# EAGLE board sboardnew (EAGLE 6.6.0), part 1 of 2
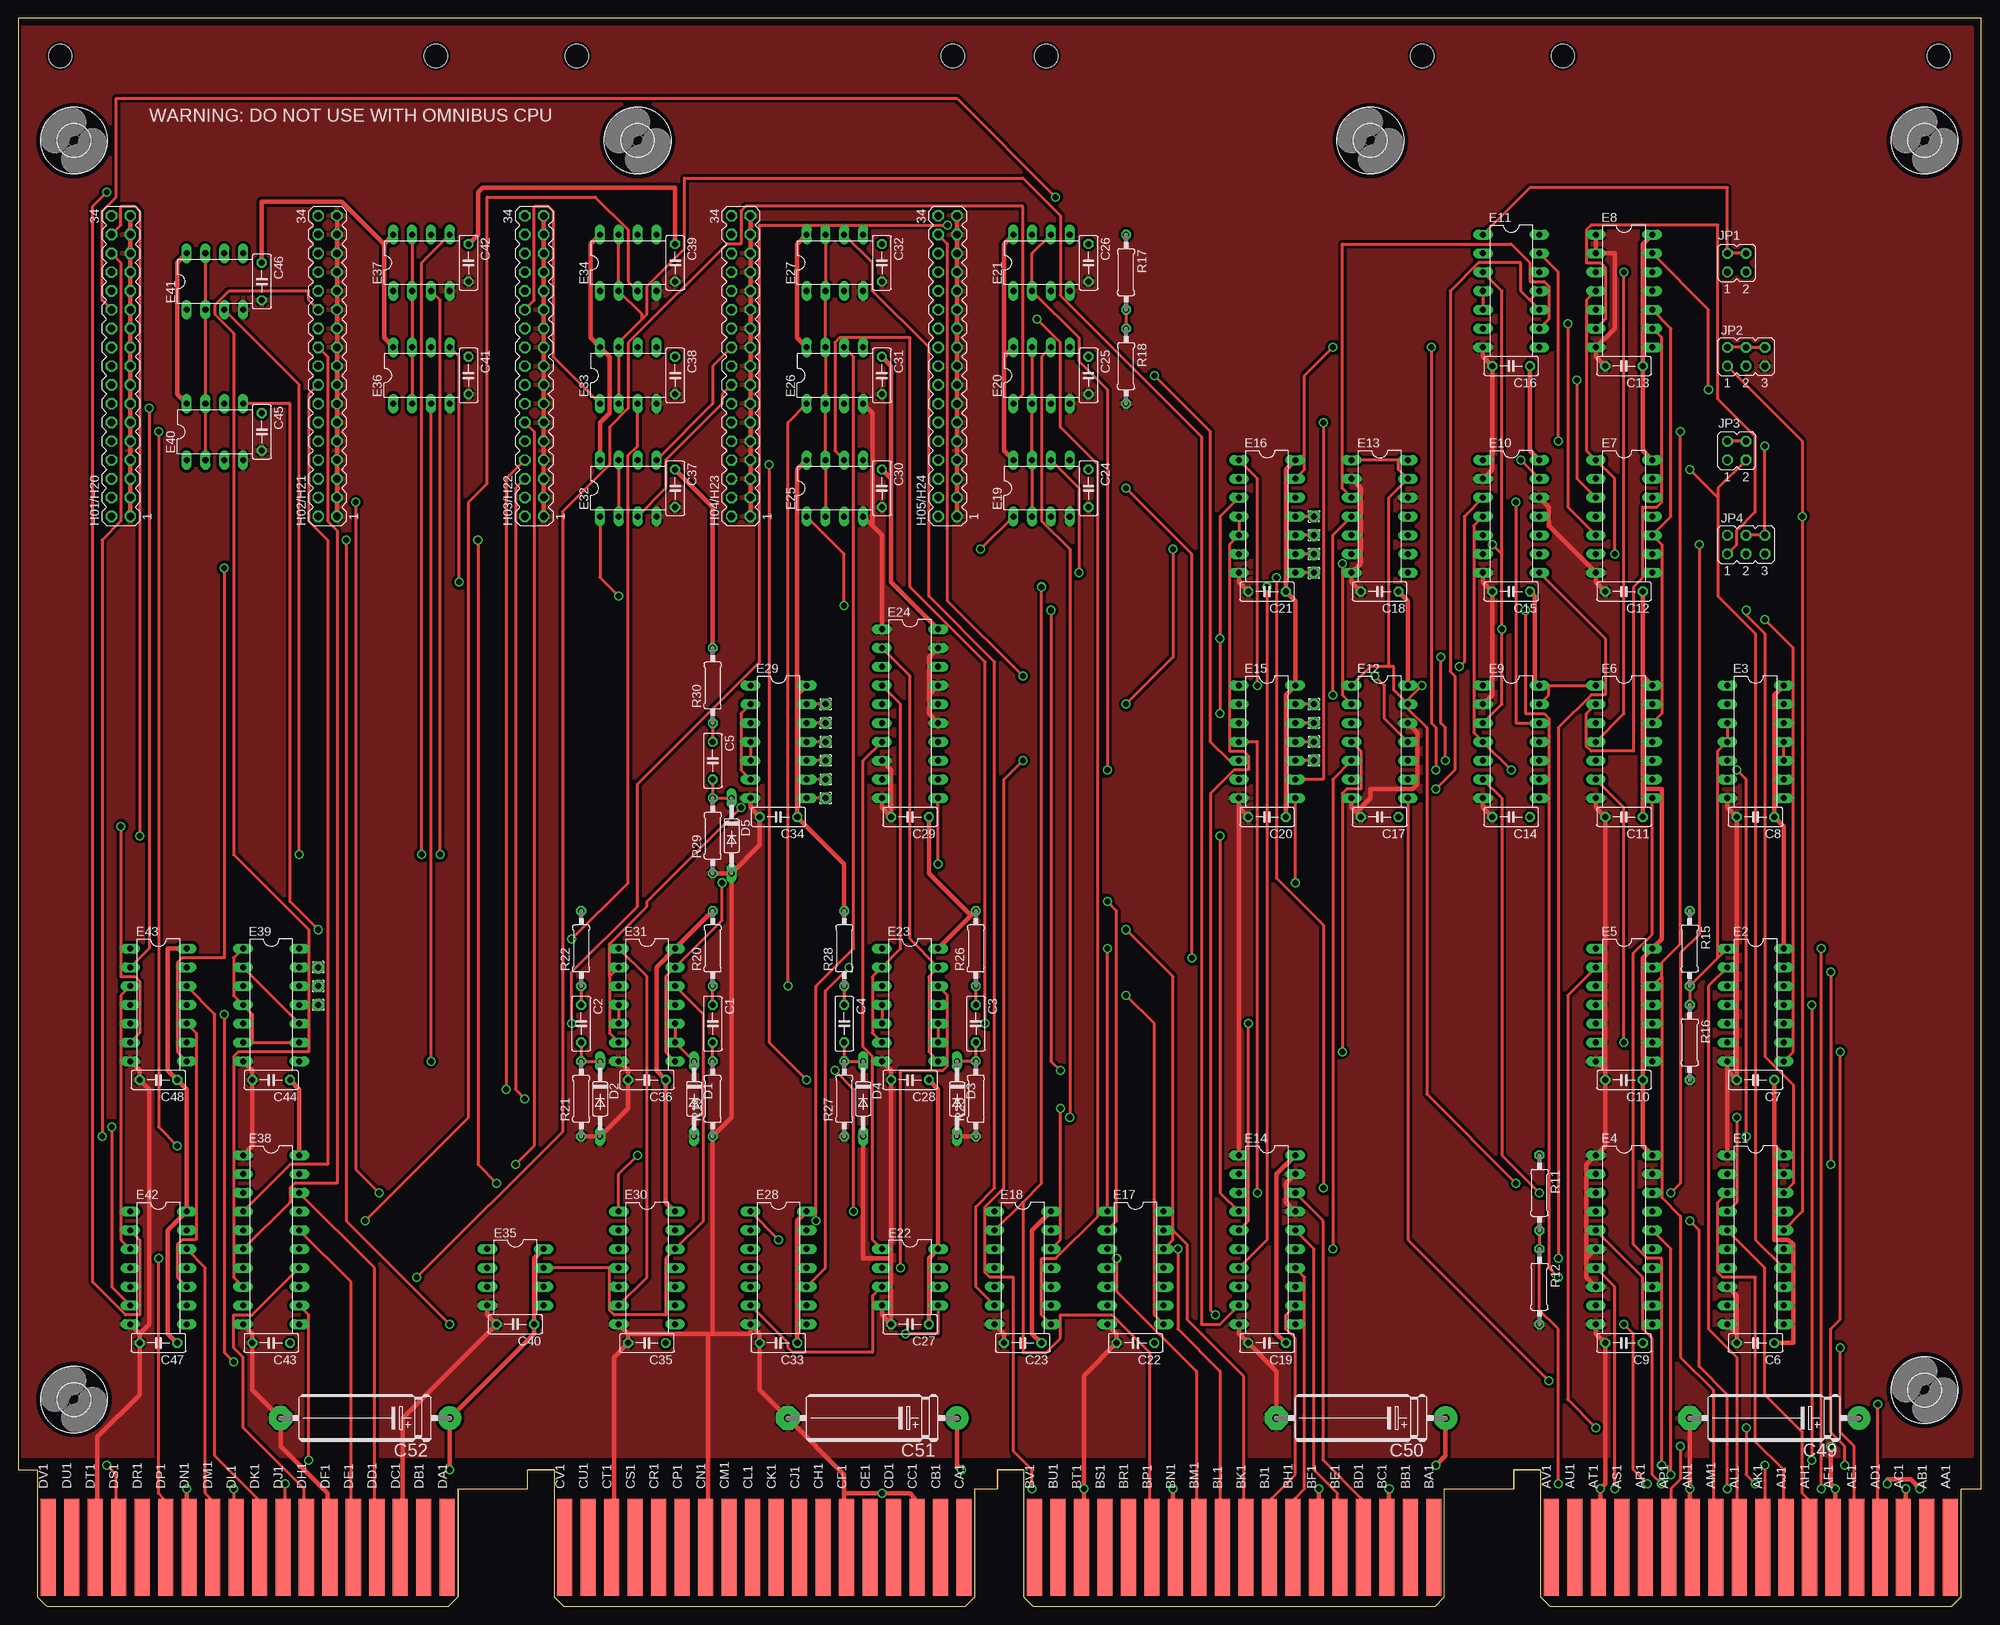
[diagram p5: board, top side]
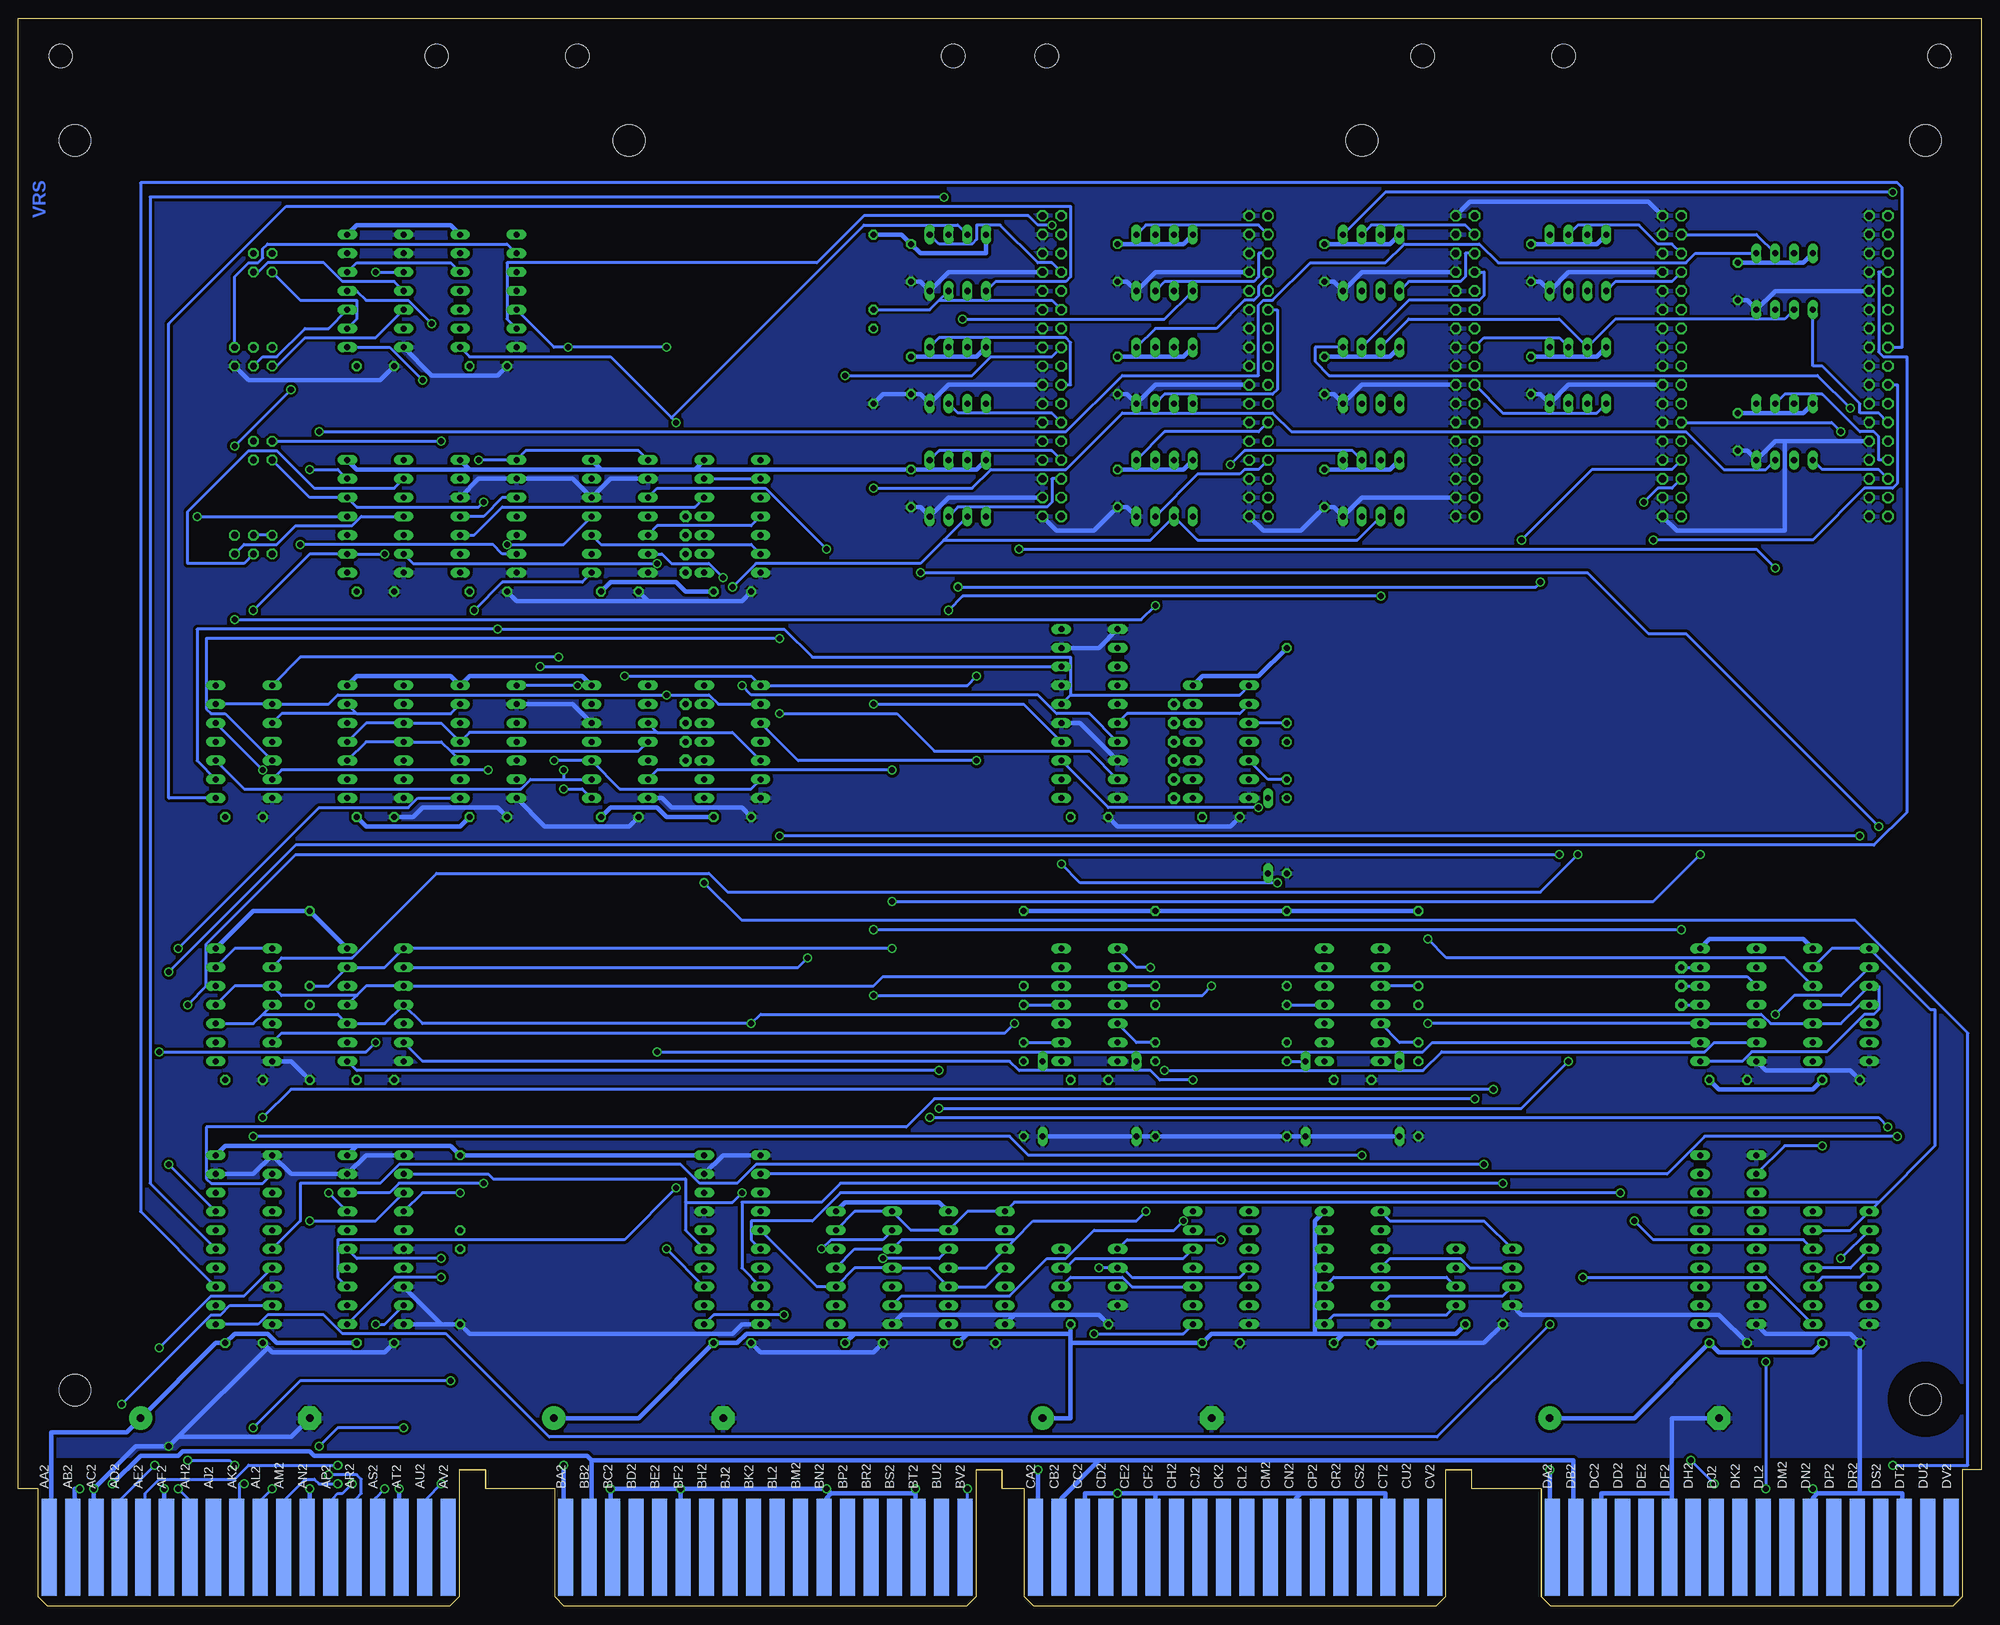
[diagram p6: board, bottom side, seen from below]

Size 265.3 x 214.63 mm. Coordinates in mm from the lower left corner, seen from the top.
Copper layers (1+16): Top 0.035mm / dielectric 1.5mm / Bottom 0.035mm
Design rules "16mils": minimum track width 16mil, minimum drill 32mil, track to track 15mil, track to pad 10mil, pad to pad 10mil, via to via 10mil, smd to smd 10mil, copper to edge 13mil, drill to drill 10mil, minimum pad ring 10mil, minimum via ring 8mil, stop-mask expansion 0mil, vias tented up to drill 0mil, thermal gap 10mil
Net classes: 1 Power: width 0.635 mm

## Footprints (pad centres in the part's own frame; a part is rotated, then mirrored left to right if it is on the bottom)
C050-025X075 = drill 0.813 octagon: 1 -2.54,0; 2 2.54,0
E22-6 = drill 1.016 pad 3.15: + -11.43,0 | drill 1.016 pad 3.15 octagon: - 11.43,0
DO35-10 = drill 0.813 long: A 5.08,0; C -5.08,0
DIL20 = drill 0.813 long: 1 -11.43,-3.81; 2 -8.89,-3.81; 3 -6.35,-3.81; 4 -3.81,-3.81; 5 -1.27,-3.81; 6 1.27,-3.81; 7 3.81,-3.81; 8 6.35,-3.81; 9 8.89,-3.81; 10 11.43,-3.81; 11 11.43,3.81; 12 8.89,3.81; 13 6.35,3.81; 14 3.81,3.81; 15 1.27,3.81; 16 -1.27,3.81; 17 -3.81,3.81; 18 -6.35,3.81; 19 -8.89,3.81; 20 -11.43,3.81
DIL14 = drill 0.813 long: 1 -7.62,-3.81; 2 -5.08,-3.81; 3 -2.54,-3.81; 4 0,-3.81; 5 2.54,-3.81; 6 5.08,-3.81; 7 7.62,-3.81; 8 7.62,3.81; 9 5.08,3.81; 10 2.54,3.81; 11 0,3.81; 12 -2.54,3.81; 13 -5.08,3.81; 14 -7.62,3.81
DIL08 = drill 0.813 long: 1 -3.81,-3.81; 2 -1.27,-3.81; 3 1.27,-3.81; 4 3.81,-3.81; 5 3.81,3.81; 6 1.27,3.81; 7 -1.27,3.81; 8 -3.81,3.81
MA17-2 = drill 1.016 octagon: 1 -20.32,-1.27; 2 -20.32,1.27; 3 -17.78,-1.27; 4 -17.78,1.27; 5 -15.24,-1.27; 6 -15.24,1.27; 7 -12.7,-1.27; 8 -12.7,1.27; 9 -10.16,-1.27; 10 -10.16,1.27; 11 -7.62,-1.27; 12 -7.62,1.27; 13 -5.08,-1.27; 14 -5.08,1.27; 15 -2.54,-1.27; 16 -2.54,1.27; 17 0,-1.27; 18 0,1.27; 19 2.54,-1.27; 20 2.54,1.27; 21 5.08,-1.27; 22 5.08,1.27; 23 7.62,-1.27; 24 7.62,1.27; 25 10.16,-1.27; 26 10.16,1.27; 27 12.7,-1.27; 28 12.7,1.27; 29 15.24,-1.27; 30 15.24,1.27; 31 17.78,-1.27; 32 17.78,1.27; 33 20.32,-1.27; 34 20.32,1.27
JP2Q = drill 0.914 octagon: 1 -1.27,-1.27; 2 -1.27,1.27; 3 1.27,-1.27; 4 1.27,1.27
JP3Q = drill 0.914 octagon: 1 -2.54,-1.27; 2 -2.54,1.27; 3 0,-1.27; 4 0,1.27; 5 2.54,-1.27; 6 2.54,1.27
1,6/0,8 = drill 0.813 pad 1.6 octagon: 1 0,0
0207/10 = drill 0.813 octagon: 1 -5.08,0; 2 5.08,0
EDGE-CON8 = smd 2.032 x 13.106: AA1 261.303,7.938; AB1 258.127,7.938; AC1 254.952,7.938; AD1 251.778,7.938; AE1 248.602,7.938; AF1 245.428,7.938; AH1 242.252,7.938; AJ1 239.077,7.938; AK1 235.903,7.938; AL1 232.727,7.938; AM1 229.553,7.938; AN1 226.377,7.938; AP1 223.202,7.938; AR1 220.028,7.938; AS1 216.852,7.938; AT1 213.678,7.938; AU1 210.502,7.938; AV1 207.327,7.938; BA1 191.452,7.938; BB1 188.278,7.938; BC1 185.102,7.938; BD1 181.928,7.938; BE1 178.752,7.938; BF1 175.577,7.938; BH1 172.403,7.938; BJ1 169.227,7.938; BK1 166.053,7.938; BL1 162.877,7.938; BM1 159.702,7.938; BN1 156.528,7.938; BP1 153.352,7.938; BR1 150.178,7.938; BS1 147.002,7.938; BT1 143.827,7.938; BU1 140.653,7.938; BV1 137.477,7.938; CA1 127.953,7.938; CB1 124.778,7.938; CC1 121.603,7.938; CD1 118.427,7.938; CE1 115.252,7.938; CF1 112.078,7.938; CH1 108.903,7.938; CJ1 105.728,7.938; CK1 102.552,7.938; CL1 99.377,7.938; CM1 96.203,7.938; CN1 93.028,7.938; CP1 89.853,7.938; CR1 86.677,7.938; CS1 83.502,7.938; CT1 80.328,7.938; CU1 77.153,7.938; CV1 73.978,7.938; DA1 58.102,7.938; DB1 54.928,7.938; DC1 51.752,7.938; DD1 48.578,7.938; DE1 45.403,7.938; DF1 42.227,7.938; DH1 39.053,7.938; DJ1 35.877,7.938; DK1 32.703,7.938; DL1 29.527,7.938; DM1 26.352,7.938; DN1 23.177,7.938; DP1 20.003,7.938; DR1 16.828,7.938; DS1 13.652,7.938; DT1 10.477,7.938; DU1 7.303,7.938; DV1 4.128,7.938 | smd 2.032 x 13.106 bottom: AA2 261.303,7.938; AB2 258.127,7.938; AC2 254.952,7.938; AD2 251.778,7.938; AE2 248.602,7.938; AF2 245.428,7.938; AH2 242.252,7.938; AJ2 239.077,7.938; AK2 235.903,7.938; AL2 232.727,7.938; AM2 229.553,7.938; AN2 226.377,7.938; AP2 223.202,7.938; AR2 220.028,7.938; AS2 216.852,7.938; AT2 213.678,7.938; AU2 210.502,7.938; AV2 207.327,7.938; BA2 191.452,7.938; BB2 188.278,7.938; BC2 185.102,7.938; BD2 181.928,7.938; BE2 178.752,7.938; BF2 175.577,7.938; BH2 172.403,7.938; BJ2 169.227,7.938; BK2 166.053,7.938; BL2 162.877,7.938; BM2 159.702,7.938; BN2 156.528,7.938; BP2 153.352,7.938; BR2 150.178,7.938; BS2 147.002,7.938; BT2 143.827,7.938; BU2 140.653,7.938; BV2 137.477,7.938; CA2 127.953,7.938; CB2 124.778,7.938; CC2 121.603,7.938; CD2 118.427,7.938; CE2 115.252,7.938; CF2 112.078,7.938; CH2 108.903,7.938; CJ2 105.728,7.938; CK2 102.552,7.938; CL2 99.377,7.938; CM2 96.203,7.938; CN2 93.028,7.938; CP2 89.853,7.938; CR2 86.677,7.938; CS2 83.502,7.938; CT2 80.328,7.938; CU2 77.153,7.938; CV2 73.978,7.938; DA2 58.102,7.938; DB2 54.928,7.938; DC2 51.752,7.938; DD2 48.578,7.938; DE2 45.403,7.938; DF2 42.227,7.938; DH2 39.053,7.938; DJ2 35.877,7.938; DK2 32.703,7.938; DL2 29.527,7.938; DM2 26.352,7.938; DN2 23.177,7.938; DP2 20.003,7.938; DR2 16.828,7.938; DS2 13.652,7.938; DT2 10.477,7.938; DU2 7.303,7.938; DV2 4.128,7.938
OMNIBUS = hole 3.175: 208.915,209.55; 259.715,209.55; 189.865,209.55; 139.065,209.55; 75.616,209.55; 126.416,209.55; 56.566,209.55; 5.766,209.55
4,3 = hole 4.3: 0,0

## Placement (x,y rotation side)
C1  .22uf  [C050-025X075]  93.85,78.74 270 top
C2  .22uf  [C050-025X075]  76.07,78.74 270 top
C3  .22uf  [C050-025X075]  129.41,78.74 270 top
C4  .22uf  [C050-025X075]  111.63,78.74 270 top
C5  .22uf  [C050-025X075]  93.85,114.3 270 top
C6  [C050-025X075]  234.82,35.56 180 top
C7  [C050-025X075]  234.82,71.12 180 top
C8  [C050-025X075]  234.82,106.68 180 top
C9  [C050-025X075]  217.04,35.56 180 top
C10  [C050-025X075]  217.04,71.12 180 top
C11  [C050-025X075]  217.04,106.68 180 top
C12  [C050-025X075]  217.04,137.16 180 top
C13  [C050-025X075]  217.04,167.64 180 top
C14  [C050-025X075]  201.8,106.68 180 top
C15  [C050-025X075]  201.8,137.16 180 top
C16  [C050-025X075]  201.8,167.64 180 top
C17  [C050-025X075]  184.02,106.68 180 top
C18  [C050-025X075]  184.02,137.16 180 top
C19  [C050-025X075]  168.78,35.56 180 top
C20  [C050-025X075]  168.78,106.68 180 top
C21  [C050-025X075]  168.78,137.16 180 top
C22  [C050-025X075]  151,35.56 180 top
C23  [C050-025X075]  135.76,35.56 180 top
C24  [C050-025X075]  144.65,151.13 270 top
C25  [C050-025X075]  144.65,166.37 270 top
C26  [C050-025X075]  144.65,181.61 270 top
C27  [C050-025X075]  120.52,38.1 180 top
C28  [C050-025X075]  120.52,71.12 180 top
C29  [C050-025X075]  120.52,106.68 180 top
C30  [C050-025X075]  116.71,151.13 270 top
C31  [C050-025X075]  116.71,166.37 270 top
C32  [C050-025X075]  116.71,181.61 270 top
C33  [C050-025X075]  102.74,35.56 180 top
C34  [C050-025X075]  102.74,106.68 180 top
C35  [C050-025X075]  84.96,35.56 180 top
C36  [C050-025X075]  84.96,71.12 180 top
C37  [C050-025X075]  88.77,151.13 270 top
C38  [C050-025X075]  88.77,166.37 270 top
C39  [C050-025X075]  88.77,181.61 270 top
C40  [C050-025X075]  67.18,38.1 180 top
C41  [C050-025X075]  60.83,166.37 270 top
C42  [C050-025X075]  60.83,181.61 270 top
C43  [C050-025X075]  34.16,35.56 180 top
C44  [C050-025X075]  34.16,71.12 180 top
C45  [C050-025X075]  32.89,158.75 270 top
C46  [C050-025X075]  32.89,179.07 270 top
C47  [C050-025X075]  18.92,35.56 180 top
C48  [C050-025X075]  18.92,71.12 180 top
C49  [E22-6]  237.36,25.4 180 top
C50  [E22-6]  181.48,25.4 180 top
C51  [E22-6]  115.44,25.4 180 top
C52  [E22-6]  46.86,25.4 180 top
D1  D664  [DO35-10]  91.31,68.58 270 top
D2  D664  [DO35-10]  78.61,68.58 270 top
D3  D664  [DO35-10]  126.87,68.58 270 top
D4  D664  [DO35-10]  114.17,68.58 270 top
D5  D664  [DO35-10]  96.39,104.14 270 top
E1  74S240N  [DIL20]  234.82,49.53 270 top
E2  74S74N  [DIL14]  234.82,81.28 270 top
E3  7410N  [DIL14]  234.82,116.84 270 top
E4  74S240N  [DIL20]  217.04,49.53 270 top
E5  74S74N  [DIL14]  217.04,81.28 270 top
E6  74S74N  [DIL14]  217.04,116.84 270 top
E7  7404N  [DIL14]  217.04,147.32 270 top
E8  7400N  [DIL14]  217.04,177.8 270 top
E9  74S74N  [DIL14]  201.8,116.84 270 top
E10  74S74N  [DIL14]  201.8,147.32 270 top
E11  7410N  [DIL14]  201.8,177.8 270 top
E12  74S74N  [DIL14]  184.02,116.84 270 top
E13  74S74N  [DIL14]  184.02,147.32 270 top
E14  74S240N  [DIL20]  168.78,49.53 270 top
E15  7404N  [DIL14]  168.78,116.84 270 top
E16  7410N  [DIL14]  168.78,147.32 270 top
E17  74S74N  [DIL14]  151,45.72 270 top
E18  74S74N  [DIL14]  135.76,45.72 270 top
E19  DS75453N  [DIL08]  138.3,151.13 0 top
E20  DS75453N  [DIL08]  138.3,166.37 0 top
E21  DS75453N  [DIL08]  138.3,181.61 0 top
E22  DS1100M-250  [DIL08]  120.52,44.45 270 top
E23  7400N  [DIL14]  120.52,81.28 270 top
E24  74S240N  [DIL20]  120.52,120.65 270 top
E25  DS75453N  [DIL08]  110.36,151.13 0 top
E26  DS75453N  [DIL08]  110.36,166.37 0 top
E27  DS75453N  [DIL08]  110.36,181.61 0 top
E28  DS1005-250  [DIL14]  102.74,45.72 270 top
E29  7400N  [DIL14]  102.74,116.84 270 top
E30  DS1005-250  [DIL14]  84.96,45.72 270 top
E31  7400N  [DIL14]  84.96,81.28 270 top
E32  DS75453N  [DIL08]  82.42,151.13 0 top
E33  DS75453N  [DIL08]  82.42,166.37 0 top
E34  DS75453N  [DIL08]  82.42,181.61 0 top
E35  DS1100M-250  [DIL08]  67.18,44.45 270 top
E36  DS75453N  [DIL08]  54.48,166.37 0 top
E37  DS75453N  [DIL08]  54.48,181.61 0 top
E38  74S240N  [DIL20]  34.16,49.53 270 top
E39  7400N  [DIL14]  34.16,81.28 270 top
E40  DS75453N  [DIL08]  26.54,158.75 0 top
E41  DS75453N  [DIL08]  26.54,179.07 0 top
E42  74S74N  [DIL14]  18.92,45.72 270 top
E43  74S74N  [DIL14]  18.92,81.28 270 top
H01/H20  [MA17-2]  13.84,167.64 90 top
H02/H21  [MA17-2]  41.78,167.64 90 top
H03/H22  [MA17-2]  69.72,167.64 90 top
H04/H23  [MA17-2]  97.66,167.64 90 top
H05/H24  [MA17-2]  125.6,167.64 90 top
JP1  [JP2Q]  232.28,181.61 0 top
JP2  [JP3Q]  233.55,168.91 0 top
JP3  [JP2Q]  232.28,156.21 0 top
JP4  [JP3Q]  233.55,143.51 0 top
PAD12  [1,6/0,8]  175.13,116.84 0 top
PAD13  [1,6/0,8]  175.13,114.3 0 top
PAD14  [1,6/0,8]  175.13,121.92 0 top
PAD15  [1,6/0,8]  175.13,119.38 0 top
PAD27  [1,6/0,8]  175.13,142.24 180 top
PAD28  [1,6/0,8]  175.13,144.78 180 top
PAD29  [1,6/0,8]  175.13,147.32 180 top
PAD30  [1,6/0,8]  175.13,139.7 180 top
PAD31  [1,6/0,8]  109.09,111.76 0 top
PAD32  [1,6/0,8]  109.09,114.3 0 top
PAD33  [1,6/0,8]  109.09,109.22 0 top
PAD34  [1,6/0,8]  109.09,119.38 0 top
PAD35  [1,6/0,8]  109.09,121.92 0 top
PAD36  [1,6/0,8]  109.09,116.84 0 top
PAD42  [1,6/0,8]  40.51,83.82 0 top
PAD43  [1,6/0,8]  40.51,86.36 0 top
PAD44  [1,6/0,8]  40.51,81.28 0 top
R11  330  [0207/10]  205.61,55.88 270 top
R12  750  [0207/10]  205.61,43.18 270 top
R15  330  [0207/10]  225.93,88.9 270 top
R16  750  [0207/10]  225.93,76.2 270 top
R17  330  [0207/10]  149.73,180.34 270 top
R18  750  [0207/10]  149.73,167.64 270 top
R19  330  [0207/10]  93.85,68.58 90 top
R20  330  [0207/10]  93.85,88.9 90 top
R21  330  [0207/10]  76.07,68.58 90 top
R22  330  [0207/10]  76.07,88.9 90 top
R25  330  [0207/10]  129.41,68.58 90 top
R26  330  [0207/10]  129.41,88.9 90 top
R27  330  [0207/10]  111.63,68.58 90 top
R28  330  [0207/10]  111.63,88.9 90 top
R29  330  [0207/10]  93.85,104.14 90 top
R30  330  [0207/10]  93.85,124.46 90 top
U$1  [EDGE-CON8]  -0.13,0 0 top
U$2  OUTLINE-OMNIBUS  [OMNIBUS]  -0.13,0 0 top
U$20  [4,3]  257.68,198.12 270 top
U$66  [4,3]  83.69,198.12 270 top
U$67  [4,3]  182.75,198.12 270 top
U$82  [4,3]  257.68,29.21 270 top
U$83  [4,3]  7.49,27.94 270 top
U$86  [4,3]  7.49,198.12 270 top